# Altium schematic sheet MB1297_POWER.SchDoc: POWER SUPPLY
size A4; DocumentNumber: MB1297; Revision: C; SheetNumber: 8; SheetTotal: 11
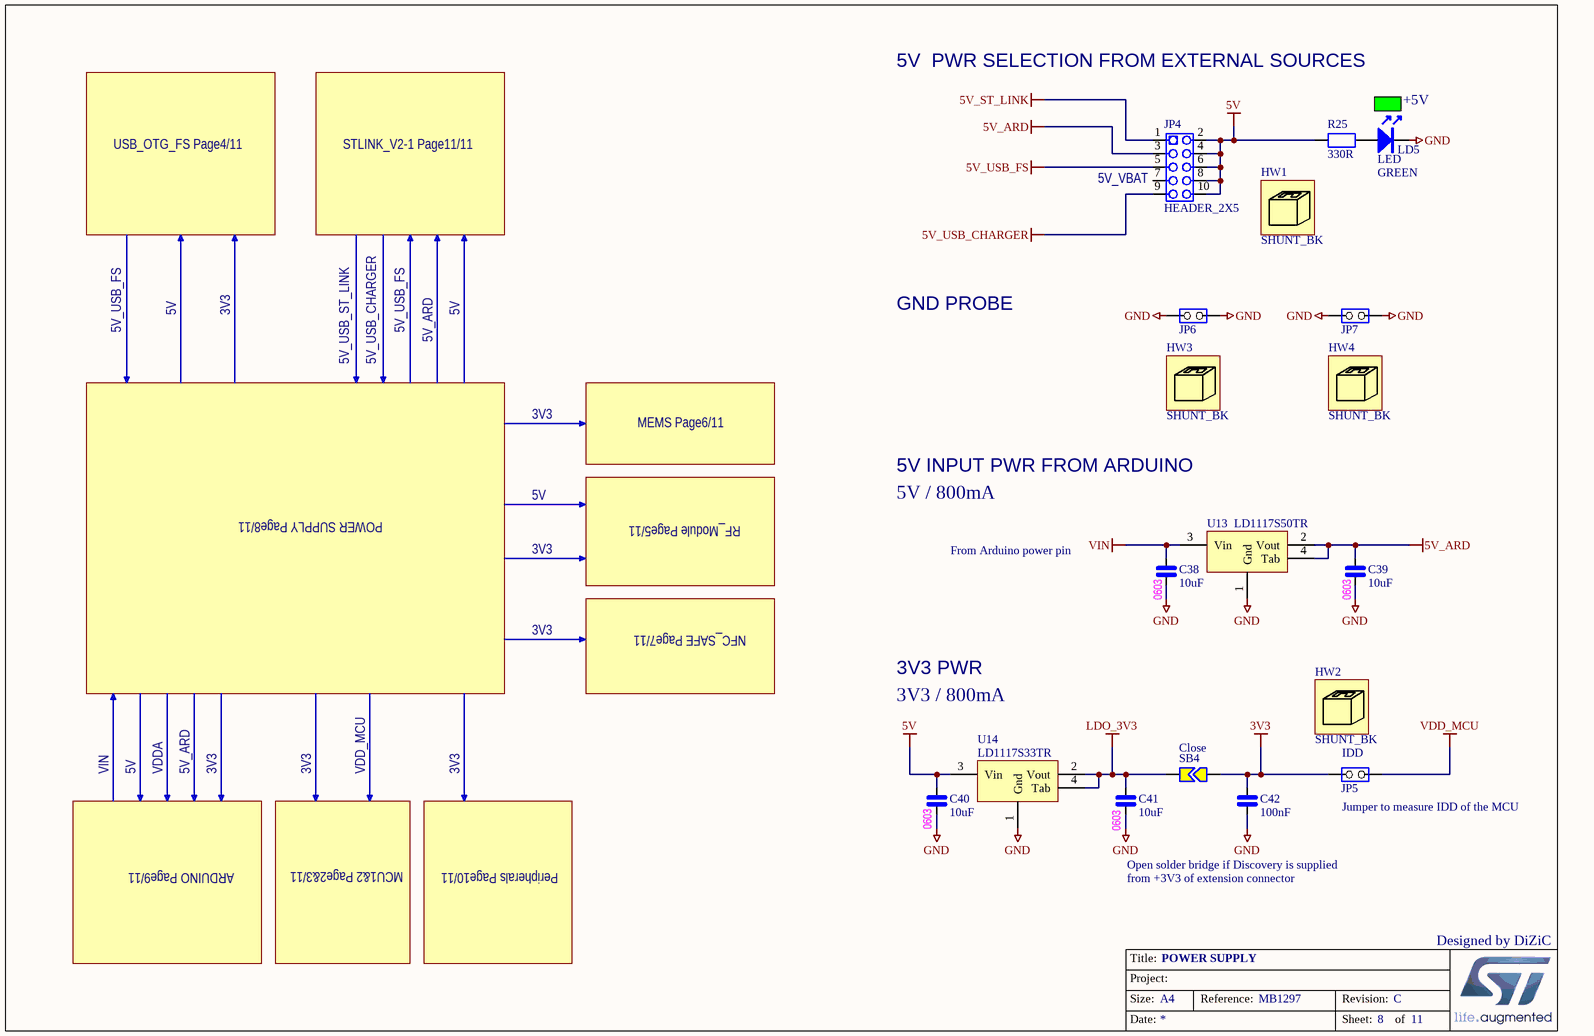
[diagram p0: MB1297_POWER.SchDoc]

## Parts
C38  10uF  [0603_CAP_NPOL]
C39  10uF  [0603_CAP_NPOL]
C40  10uF  [0603_CAP_NPOL]
C41  10uF  [0603_CAP_NPOL]
C42  100nF  [0402_CAP_NPOL]
HW1  SHUNT_BK  (mechanical)
HW2  SHUNT_BK  (mechanical)
HW3  SHUNT_BK  (mechanical)
HW4  SHUNT_BK  (mechanical)
JP4  HEADER_2X5  [Header M 2x5x2.54 TH V]
JP5  Jumper_2.54mm  [CON_SAMTEC_TSW-102-07-G-S]  (value not drawn)
JP6  Jumper_2.54mm  [CON_SAMTEC_TSW-102-07-G-S]  (value not drawn)
JP7  Jumper_2.54mm  [CON_SAMTEC_TSW-102-07-G-S]  (value not drawn)
LD5  LED  Color: GREEN  [0603_LED_GREEN]
R25  330R  [0402_RES]
SB4  Close  [SB]
U13  LD1117S50TR  [REG_SOT223-TAB]
U14  LD1117S33TR  [REG_SOT223-TAB]

## Nets
3V3: C42.1 JP5.1(COMMON) SB4.2
5V: C40.1 JP4.2 JP4.4 JP4.6 JP4.8 JP4.10 R25.1 U14.3(Vin)
5V_ARD: C39.1 JP4.3 U13.2(Vout) U13.4(Tab)
5V_ST_LINK: JP4.1
5V_USB_CHARGER: JP4.9
5V_USB_FS: JP4.5
GND: C38.2 C39.2 C40.2 C41.2 C42.2 JP6.1(COMMON) JP6.2(NO) JP7.1(COMMON) JP7.2(NO) LD5.K U13.1(Gnd) U14.1(Gnd)
LDO_3V3: C41.1 SB4.1 U14.2(Vout) U14.4(Tab)
VDD_MCU: JP5.2(NO)
VIN: C38.1 U13.3(Vin)
NetLD5_A: LD5.A R25.2

Not connected (* = marked no-connect by the designer): JP4 7

## Notes on the sheet
- 5V  PWR SELECTION FROM EXTERNAL SOURCES
- (near LD5) +5V
- USB_OTG_FS Page4/11
- STLINK_V2-1 Page11/11
- (near JP4) 5V_VBAT
- 5V
- 3V3
- GND PROBE
- 5V_USB_FS
- 5V_USB_ST_LINK
- 5V_USB_CHARGER
- 5V_ARD
- MEMS Page6/11
- POWER SUPPLY Page8/11
- RF_Module Page5/11
- 5V / 800mA
- 5V INPUT PWR FROM ARDUINO
- From Arduino power pin
- NFC_SAFE Page7/11
- (near C38) 0603
- (near C39) 0603
- 3V3 / 800mA
- 3V3 PWR
- VIN
- VDDA
- VDD_MCU
- (near JP5) IDD
- (near C40) 0603
- (near C41) 0603
- (near JP5) Jumper to measure IDD of the MCU
- ARDUINO Page9/11
- MCU1&2 Page2&3/11
- Peripherals Page10/11
- Open solder bridge if Discovery is supplied
  from +3V3 of extension connector
- Designed by DiZiC
- Title:
- Project:
- Size:
- Date:
- A4
- Reference:
- Sheet:
- Revision:
- of

## Library data of the parts
C38-C42 = CAP_NPOL: Capacitor_not polarized
HW1-HW4 = Shunt 2.54mm: SHUNT 2.54mm BLACK; Manuf_1: SAMTEC; Manuf_Part_1: SNT-100-BK-G; Fitted: Manually; Ordered_By: Subcon; ECCN_US/EU: n/a; Distrib: *; Order_Code: *; Value: SHUNT_BK
JP5-JP7 = TSW-102-07-x-S: Connector jumper 1 position; Manuf_1: SAMTEC; Manuf_Part_2: 4711955140470; Manuf_2: KONTEC; Order_Code: 423-2841; Fitted: YES; Ordered_By: Subcon; ECCN_US/EU: n/a; Value: Jumper_2.54mm; Manuf_Part_1: TSW-102-07-x-S
LD5 = LED: Light-Emitting Diode; Part Number A: *
R25 = RES: Resistor
SB4 = Strap2: Solder Jumper; Solder: YES; Published: 24-Mar-1999; Revision: July-2002: Re-released for DXP Platform.; Publisher: Altium Limited
U13 = LD1117S50TR: IC REG LDO 5V 0.8A SOT223; Manuf_1: STM; ECCN_US/EU: EAR99/NEC; Ref St: 9176133; Fitted: YES; Manuf_Part_1: LD1117S50TR; Distrib: STM; Ordered_By: STM; Order_code: LD1117S50TR; Value: LD1117S50TR
U14 = LD1117S33TR: LOW DROP FIXED AND ADJUSTABLE POSITIVE VOLTAGE REGULATORS (3.3 Volts); Manuf_1: STM; ECCN_US/EU: EAR99/NEC; Fitted: YES; Manuf_Part_1: LD1117S33TR; Distrib: STM; Order_Code: LD1117S33TR; Ordered_By: STM; Value: LD1117S33TR